# EAGLE design Hexapod_Controller_Rev1 (EAGLE 9.6.2)
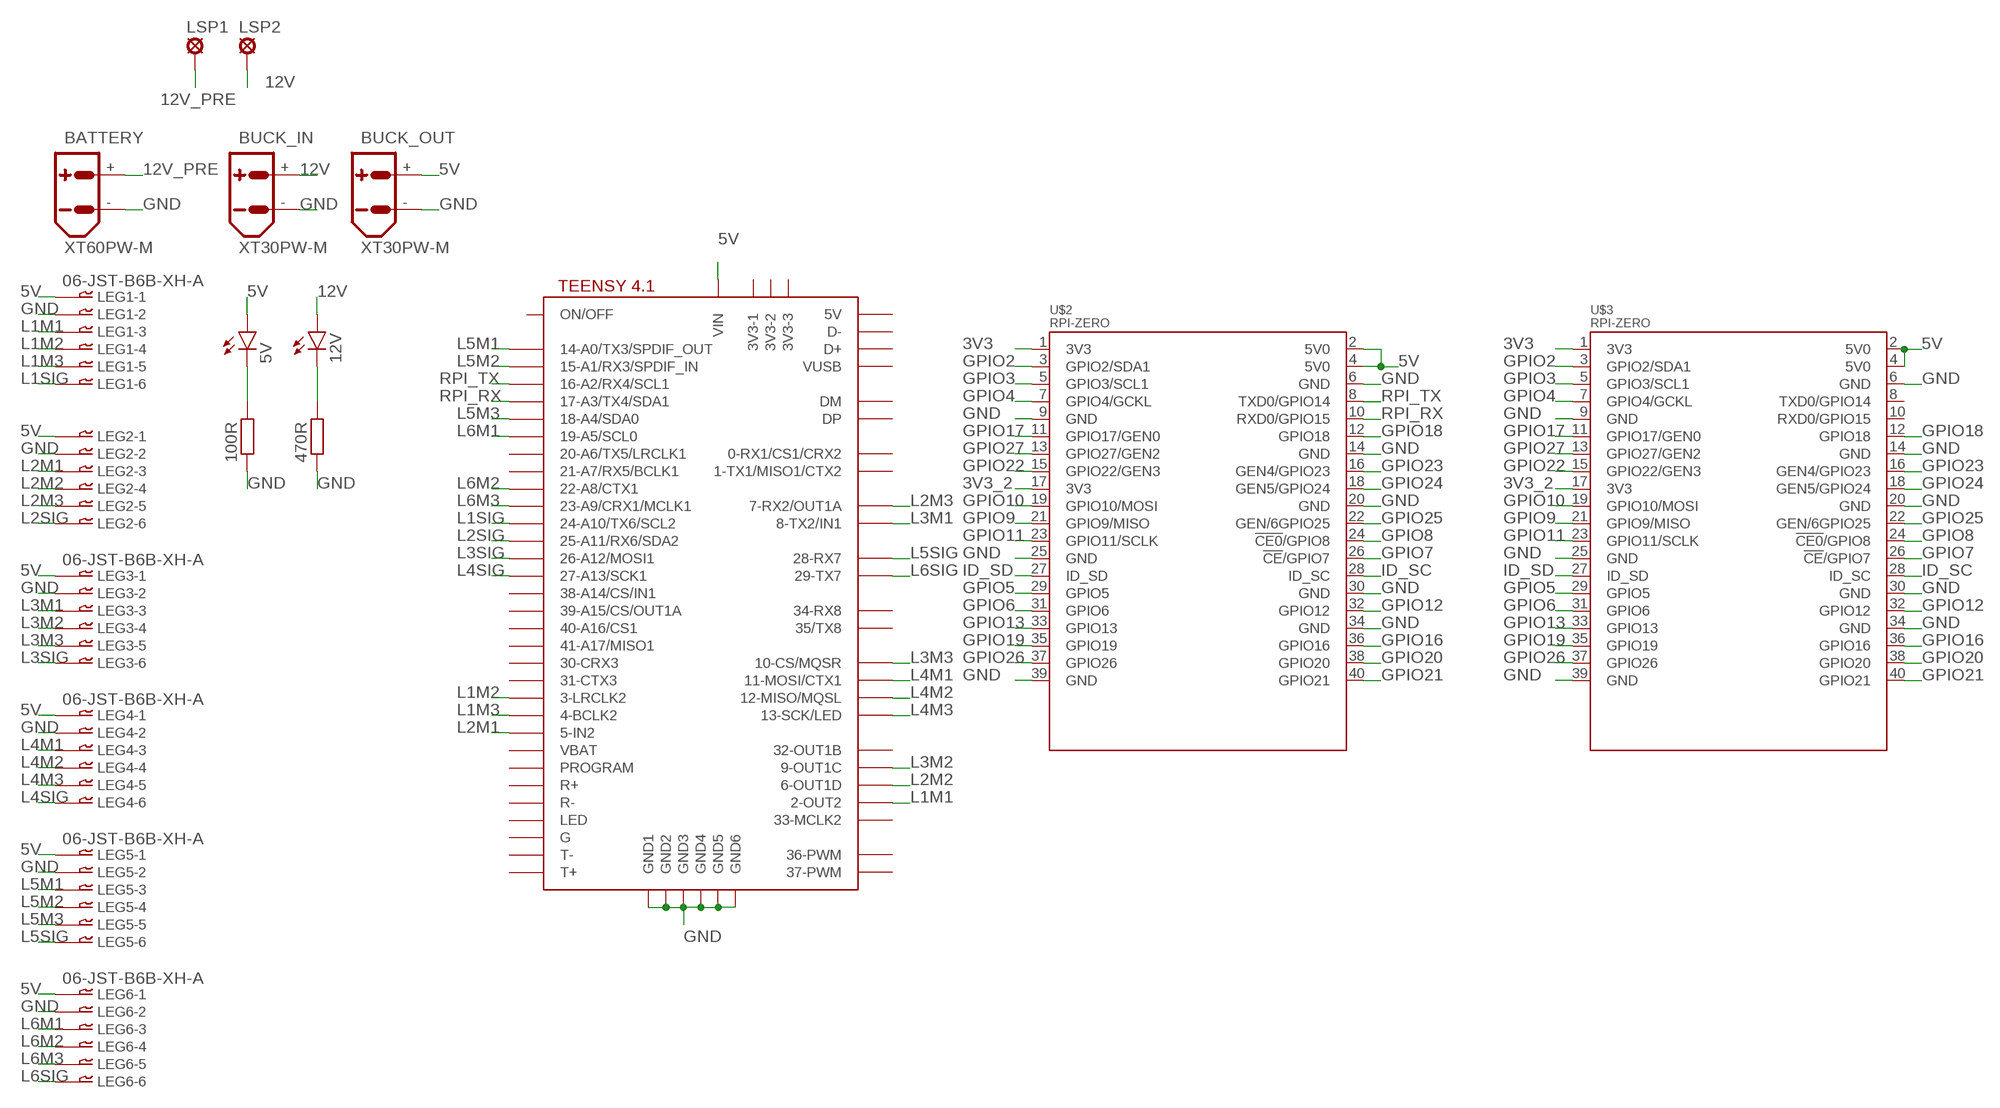
[diagram p0: schematic, sheet 1]

## Parts
5V  LEDCHIPLED_0805  [CHIPLED_0805]
12V  LEDCHIPLED_0805  [CHIPLED_0805]
100R  R-EU_R0805  [R0805]
470R  R-EU_R0805  [R0805]
BATTERY  XT60PW-M  [XT60PW-M]
BUCK_IN  XT30PW-M  [XT30PW-M]
BUCK_OUT  XT30PW-M  [XT30PW-M]
LEG1  06-JST-B6B-XH-A  [B6B-XH]
LEG2  06-JST-B6B-XH-A  [B6B-XH]
LEG3  06-JST-B6B-XH-A  [B6B-XH]
LEG4  06-JST-B6B-XH-A  [B6B-XH]
LEG5  06-JST-B6B-XH-A  [B6B-XH]
LEG6  06-JST-B6B-XH-A  [B6B-XH]
LSP1  LSP10  [LSP10]
LSP2  LSP10  [LSP10]
U$1  TEENSY41  [TEENSY41]
U$2  RPI-ZERO  [RASPBERRYPI_BASTELSTUBE_V13_RASPI_BOARD_B+_FULL]
U$3  RPI-ZERO  [RASPBERRYPI_BASTELSTUBE_V13_RASPI_BOARD_B+_FULL]

## Nets
3V3: U$2.1(3V3) U$3.1(3V3)
3V3_2: U$2.17(3V3) U$3.17(3V3)
5V: 5V.A BUCK_OUT.+ LEG1.P$1 LEG2.P$1 LEG3.P$1 LEG4.P$1 LEG5.P$1 LEG6.P$1 U$1.VIN U$2.2(5V0) U$2.4(5V0) U$3.2(5V0) U$3.4(5V0)
12V: 12V.A BUCK_IN.+ LSP2.MP
12V_PRE: BATTERY.+ LSP1.MP
GND: 100R.1 470R.1 BATTERY.- BUCK_IN.- BUCK_OUT.- LEG1.P$2 LEG2.P$2 LEG3.P$2 LEG4.P$2 LEG5.P$2 LEG6.P$2 U$1.GND1 U$1.GND2 U$1.GND3 U$1.GND4 U$1.GND5 U$1.GND6 U$2.6(GND) U$2.9(GND) U$2.14(GND) U$2.20(GND) U$2.25(GND) U$2.30(GND) U$2.34(GND) U$2.39(GND) U$3.6(GND) U$3.9(GND) U$3.14(GND) U$3.20(GND) U$3.25(GND) U$3.30(GND) U$3.34(GND) U$3.39(GND)
GPIO2: U$2.3(GPIO2/SDA1) U$3.3(GPIO2/SDA1)
GPIO3: U$2.5(GPIO3/SCL1) U$3.5(GPIO3/SCL1)
GPIO4: U$2.7(GPIO4/GCKL) U$3.7(GPIO4/GCKL)
GPIO5: U$2.29(GPIO5) U$3.29(GPIO5)
GPIO6: U$2.31(GPIO6) U$3.31(GPIO6)
GPIO7: U$2.26(!CE!/GPIO7) U$3.26(!CE!/GPIO7)
GPIO8: U$2.24(!CE0!/GPIO8) U$3.24(!CE0!/GPIO8)
GPIO9: U$2.21(GPIO9/MISO) U$3.21(GPIO9/MISO)
GPIO10: U$2.19(GPIO10/MOSI) U$3.19(GPIO10/MOSI)
GPIO11: U$2.23(GPIO11/SCLK) U$3.23(GPIO11/SCLK)
GPIO12: U$2.32(GPIO12) U$3.32(GPIO12)
GPIO13: U$2.33(GPIO13) U$3.33(GPIO13)
GPIO16: U$2.36(GPIO16) U$3.36(GPIO16)
GPIO17: U$2.11(GPIO17/GEN0) U$3.11(GPIO17/GEN0)
GPIO18: U$2.12(GPIO18) U$3.12(GPIO18)
GPIO19: U$2.35(GPIO19) U$3.35(GPIO19)
GPIO20: U$2.38(GPIO20) U$3.38(GPIO20)
GPIO21: U$2.40(GPIO21) U$3.40(GPIO21)
GPIO22: U$2.15(GPIO22/GEN3) U$3.15(GPIO22/GEN3)
GPIO23: U$2.16(GEN4/GPIO23) U$3.16(GEN4/GPIO23)
GPIO24: U$2.18(GEN5/GPIO24) U$3.18(GEN5/GPIO24)
GPIO25: U$2.22(GEN/6GPIO25) U$3.22(GEN/6GPIO25)
GPIO26: U$2.37(GPIO26) U$3.37(GPIO26)
GPIO27: U$2.13(GPIO27/GEN2) U$3.13(GPIO27/GEN2)
ID_SC: U$2.28(ID_SC) U$3.28(ID_SC)
ID_SD: U$2.27(ID_SD) U$3.27(ID_SD)
L1M1: LEG1.P$3 U$1.2-OUT2
L1M2: LEG1.P$4 U$1.3-LRCLK2
L1M3: LEG1.P$5 U$1.4-BCLK2
L1SIG: LEG1.P$6 U$1.24-A10/TX6/SCL2
L2M1: LEG2.P$3 U$1.5-IN2
L2M2: LEG2.P$4 U$1.6-OUT1D
L2M3: LEG2.P$5 U$1.7-RX2/OUT1A
L2SIG: LEG2.P$6 U$1.25-A11/RX6/SDA2
L3M1: LEG3.P$3 U$1.8-TX2/IN2(8-TX2/IN1)
L3M2: LEG3.P$4 U$1.9-OUT1C
L3M3: LEG3.P$5 U$1.10-CS\MQSR(10-CS/MQSR)
L3SIG: LEG3.P$6 U$1.26-A12/MOSI1
L4M1: LEG4.P$3 U$1.11-MOSI/CTX1
L4M2: LEG4.P$4 U$1.12-MISO/MQSL
L4M3: LEG4.P$5 U$1.13-SCK/LED
L4SIG: LEG4.P$6 U$1.27-A13/SCK1
L5M1: LEG5.P$3 U$1.14-A0/TX3/SPDIF_OUT
L5M2: LEG5.P$4 U$1.15-A1/RX3/SPDIF_IN
L5M3: LEG5.P$5 U$1.18-A4/SDA0
L5SIG: LEG5.P$6 U$1.28-RX7
L6M1: LEG6.P$3 U$1.19-A5/SCL0
L6M2: LEG6.P$4 U$1.22-A8/CTX1
L6M3: LEG6.P$5 U$1.23-A9/CRX1/MCLK1
L6SIG: LEG6.P$6 U$1.29-TX7
N$1: 5V.C 100R.2
N$2: 12V.C 470R.2
RPI_RX: U$1.17-A3/TX4/SDA1 U$2.10(RXD0/GPIO15)
RPI_TX: U$1.16-A2/RX4/SCL1 U$2.8(TXD0/GPIO14)
Unconnected: U$1.0-RX1/CS1/CRX2 U$1.1-TX1/MISO1/CTX2 U$1.3V3-1 U$1.3V3-2 U$1.3V3-3 U$1.20-A6/TX5/LRCLK1 U$1.21-A7/RX5/BCLK1 U$1.30-CRX3 U$1.31-CTX3 U$1.32-OUT1B U$1.33-MCLK2 U$1.34-RX8 U$1.35-TX8(35/TX8) U$1.36-PWM U$1.37-PWM U$1.38-A14/CS/IN1 U$1.39-A15/CS/OUT1A U$1.40-A16/CS1 U$1.41-A17/MISO1 U$1.+5V(5V) U$1.D+ U$1.D- U$1.DM U$1.DP U$1.G U$1.LED U$1.ON/OFF U$1.PROGRAM U$1.R+ U$1.R- U$1.T+ U$1.T- U$1.VBAT U$1.VUSB U$3.8(TXD0/GPIO14) U$3.10(RXD0/GPIO15)

## Library data of the parts
5V 12V = led:LED: LED OSRAM: - CHIPLED LG R971, LG N971, LY N971, LG Q971, LY Q971, LO R971, LY R971 LH N974, LH R974 LS Q976, LO Q976, LY Q976 LO Q996 - Hyper CHIPLED LW Q18S LB Q993, LB Q99A, LB R99A - SideLED LS A670, LO A670, LY A670, LG A670, LP A670 LB A673, LV A673, LT A673, LW A673 LH A674 LY A675 LS A676, LA A676, LO A676, LY A676, LW A676 LS A679, LY A679, LG A679 - Hyper Micro SIDELED® LS Y876, LA Y876, LO Y876, LY Y876 LT Y87S - SmartLED LW L88C, LW L88S LB L89C, LB L89S, LG L890 LS L89K, LO L89K, LY L89K LS L896, LA L896, LO L896, LY L896 - TOPLED LS T670, LO T670, LY T670, LG T670, LP T670 LSG T670, LSP T670, LSY T670, LOP T670, LYG T670 LG T671, LOG T671, LSG T671 LB T673, LV T673, LT T673, LW T673 LH T674 LS T676, LA T676, LO T676, LY T676, LB T676, LH T676, LSB T676, LW T676 LB T67C, LV T67C, LT T67C, LS T67K, LO T67K, LY T67K, LW E67C LS E67B, LA E67B, LO E67B, LY E67B, LB E67C, LV E67C, LT E67C LW T67C LS T679, LY T679, LG T679 LS T770, LO T770, LY T770, LG T770, LP T770 LB T773, LV T773, LT T773, LW T773 LH T774 LS E675, LA E675, LY E675, LS T675 LS T776, LA T776, LO T776, LY T776, LB T776 LHGB T686 LT T68C, LB T68C - Hyper Mini TOPLED® LB M676 - Mini TOPLED Santana® LG M470 LS M47K, LO M47K, LY M47K Source: http://www.osram.convergy.de LUXEON: - LUMILED® LXK2-PW12-R00, LXK2-PW12-S00, LXK2-PW14-U00, LXK2-PW14-V00 LXK2-PM12-R00, LXK2-PM12-S00, LXK2-PM14-U00 LXK2-PE12-Q00, LXK2-PE12-R00, LXK2-PE12-S00, LXK2-PE14-T00, LXK2-PE14-U00 LXK2-PB12-K00, LXK2-PB12-L00, LXK2-PB12-M00, LXK2-PB14-N00, LXK2-PB14-P00, LXK2-PB14-Q00 LXK2-PR12-L00, LXK2-PR12-M00, LXK2-PR14-Q00, LXK2-PR14-R00 LXK2-PD12-Q00, LXK2-PD12-R00, LXK2-PD12-S00 LXK2-PH12-R00, LXK2-PH12-S00 LXK2-PL12-P00, LXK2-PL12-Q00, LXK2-PL12-R00 Source: www.luxeon.com KINGBRIGHT: KA-3528ASYC Source: www.kingbright.com
100R 470R = rcl:R-EU_: RESISTOR, European symbol; SPICEPREFIX: R
BATTERY = amass:XT60: AMASS XT60 connector Store in Japan AMASS XT60 connector <https://szc.jp/ams-xt60>
BUCK_IN BUCK_OUT = amass:XT30: AMASS XT30 connector Store in Japan AMASS XT30 connector <https://szc.jp/ams-xt30>
LEG1-LEG6 = bt_con-jst-xh:06-JST: JST CONNECTOR
LSP1 LSP2 = solpad:LSP10: SOLDER PAD drill 1.0 mm, distributor Buerklin, 12H555
U$1 = teensy:TEENSY41
U$2 = RPI-Zero:RPI-ZERO
U$3 = RPI_outer:RPI-ZERO

## Net classes
0 default: clearance 0.205 mm

## Board
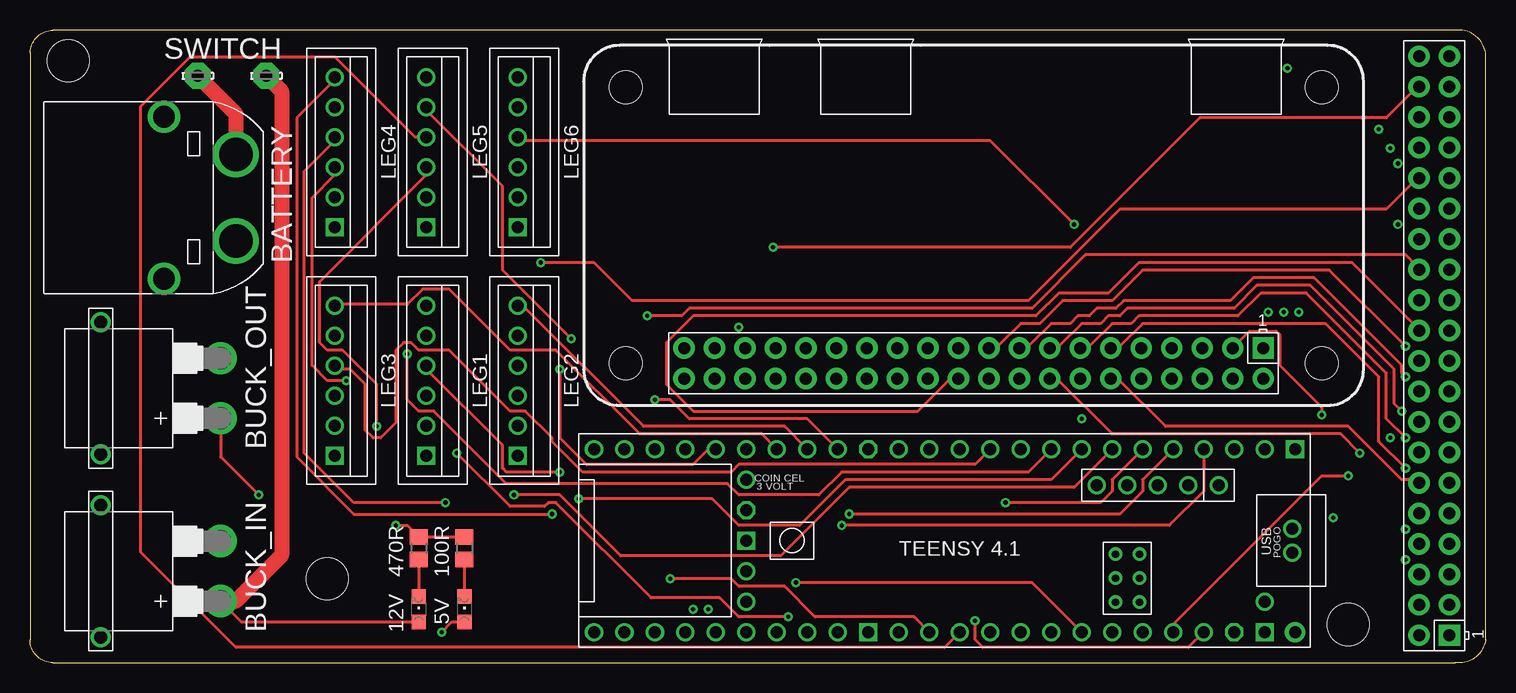
[diagram p1: board, top side]
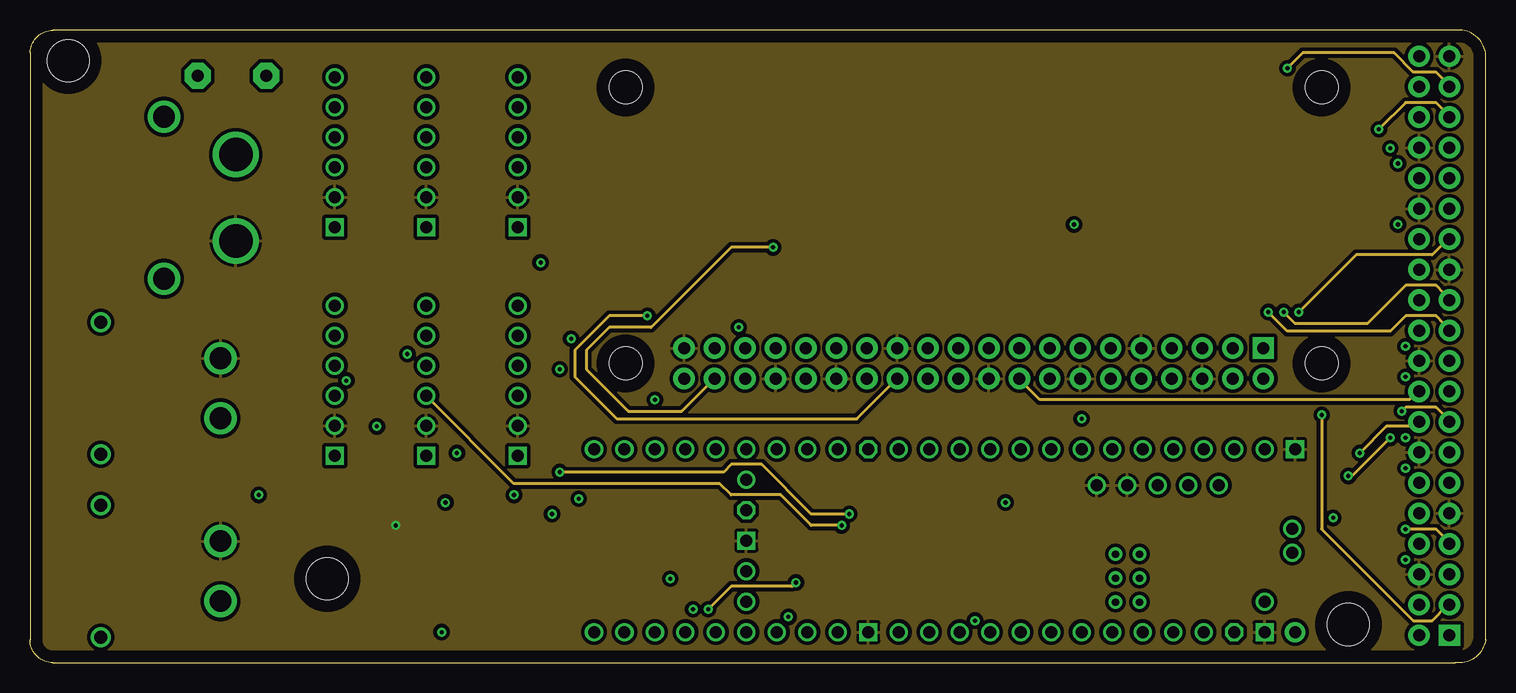
[diagram p2: board, inner layer Route2]
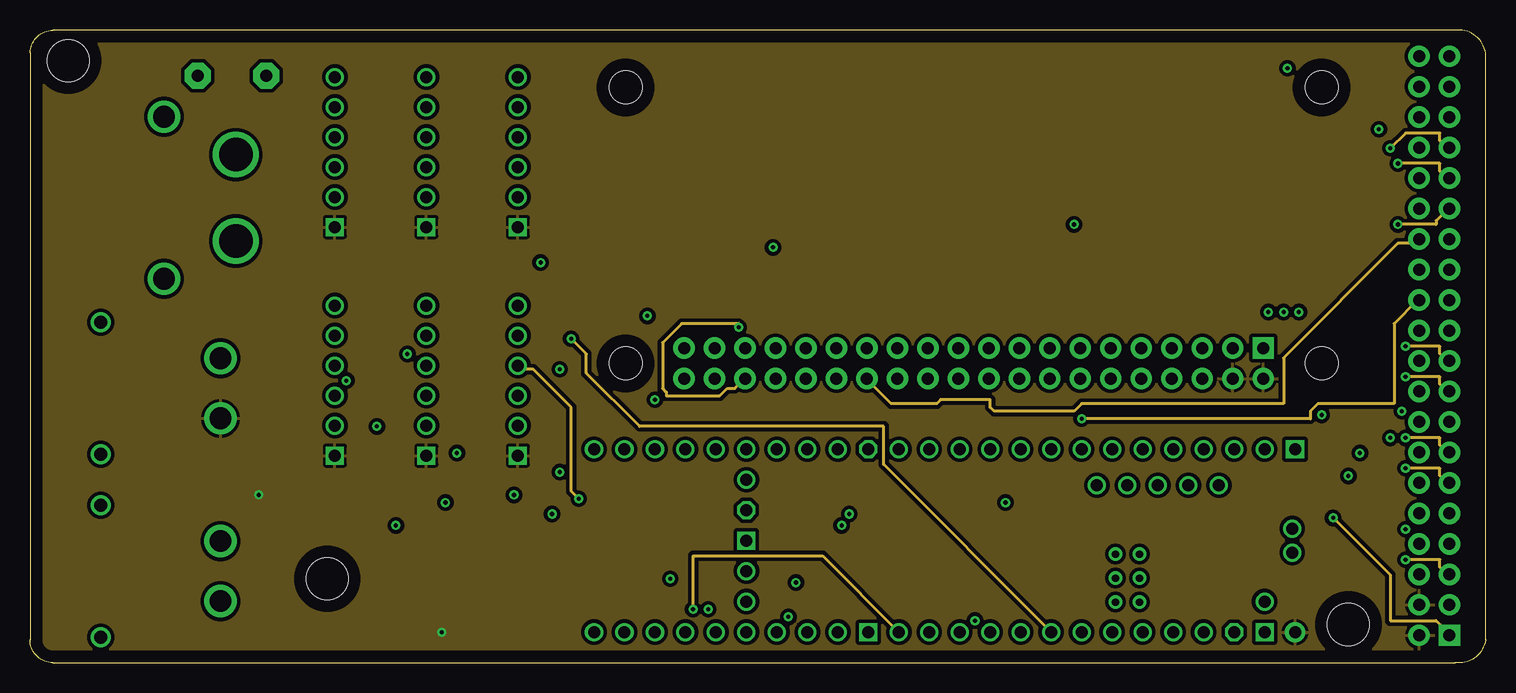
[diagram p3: board, inner layer Route15]
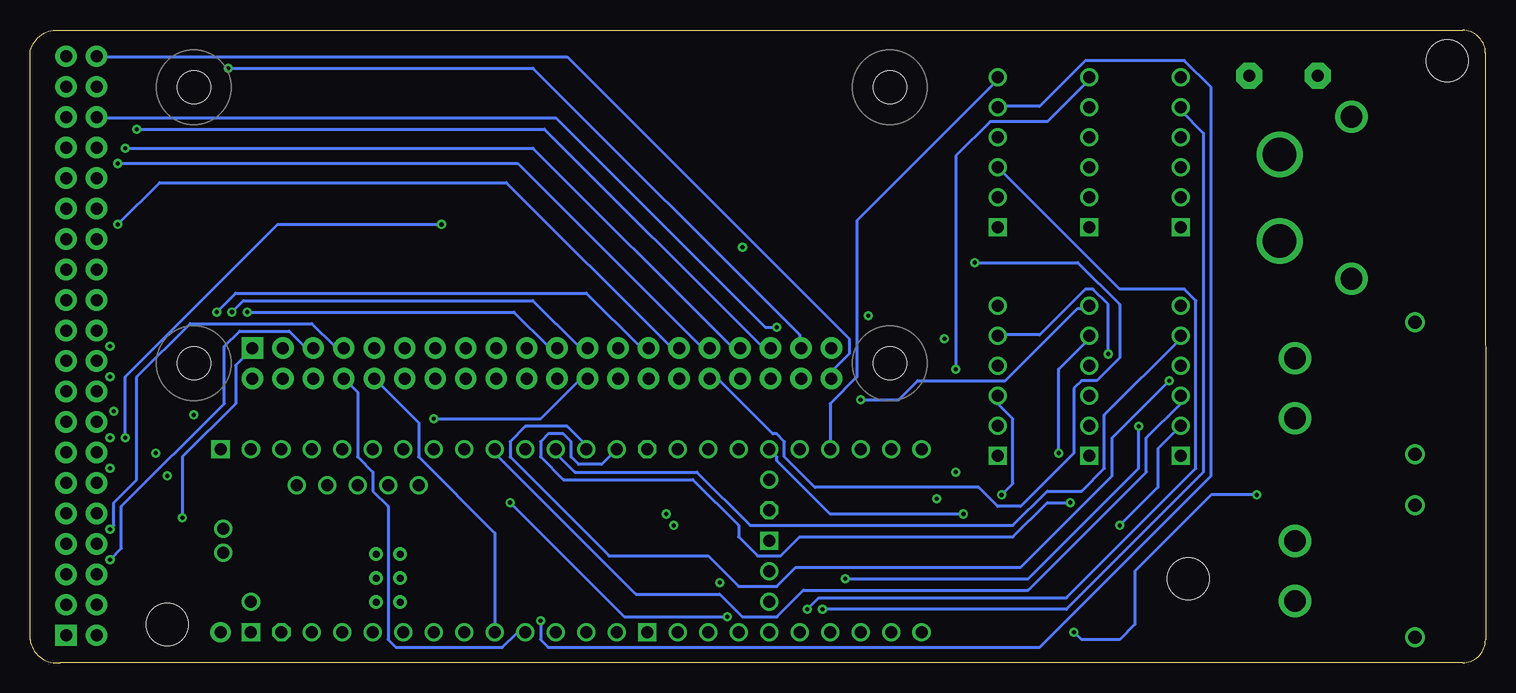
[diagram p4: board, bottom side, seen from below]

Size 121.3 x 52.74 mm. Coordinates in mm from the lower left corner, seen from the top.
Outline: 1.91,0.02 118.76,0.02 arc90 121.3,1.93 121.3,50.82 arc90 118.76,52.72 1.91,52.72 arc90 0.01,50.82 0,1.93 arc90 1.91,0.02
Copper layers (1+2*15+16): Top 0.15mm / dielectric 0.2mm / Route2 0.15mm / dielectric 0.2mm / Route15 0.15mm / dielectric 0.2mm / Bottom 0.15mm
Design rules "default *": minimum track width 10mil, minimum drill 0.35mm, track to track 12mil, track to pad 12mil, pad to pad 12mil, via to via 12mil, smd to smd 12mil, copper to edge 40mil, drill to drill 6mil, minimum pad ring 10mil, minimum via ring 8mil, stop-mask expansion 4mil, vias tented up to drill 0mil, thermal gap 10mil
Holes 3.5 mm at 3.18,50.19 24.77,7.01 109.87,3.2

### Footprints (pad centres in the part's own frame; a part is rotated, then mirrored left to right if it is on the bottom)
CHIPLED_0805 = smd 1.2 x 1.2: A 0,-1.05; C 0,1.05
R0805 = smd 1.3 x 1.5: 1 -0.95,0; 2 0.95,0
XT60PW-M = drill 2.8: + 3.6,0; - -3.6,0 | drill 1.8: P$3 -6.75,6; P$4 6.75,6
XT30PW-M = drill 1.8: + -2.5,0; - 2.5,0 | drill 1.1: P$3 -5.5,10; P$4 5.5,10
B6B-XH = drill 1 square: P$1 6.25,0 | drill 1: P$2 3.75,0; P$3 1.25,0; P$4 -1.25,0; P$5 -3.75,0; P$6 -6.25,0
LSP10 = drill 1.016 pad 2.159 octagon: MP 0,0
TEENSY41 = drill 1: 0-RX1/CS1/CRX2 -27.94,-7.62; 1-TX1/MISO1/CTX2 -25.4,-7.62; 2-OUT2 -22.86,-7.62; 3-LRCLK2 -20.32,-7.62; 4-BCLK2 -17.78,-7.62; 5-IN2 -15.24,-7.62; 6-OUT1D -12.7,-7.62; 7-RX2/OUT1A -10.16,-7.62; 8-TX2/IN2 -7.62,-7.62; 9-OUT1C -5.08,-7.62; 10-CS\MQSR -2.54,-7.62; 11-MOSI/CTX1 0,-7.62; 12-MISO/MQSL 2.54,-7.62; 13-SCK/LED 2.54,7.62; 14-A0/TX3/SPDIF_OUT 0,7.62; 15-A1/RX3/SPDIF_IN -2.54,7.62; 16-A2/RX4/SCL1 -5.08,7.62; 17-A3/TX4/SDA1 -7.62,7.62; 18-A4/SDA0 -10.16,7.62; 19-A5/SCL0 -12.7,7.62; 20-A6/TX5/LRCLK1 -15.24,7.62; 21-A7/RX5/BCLK1 -17.78,7.62; 22-A8/CTX1 -20.32,7.62; 23-A9/CRX1/MCLK1 -22.86,7.62; 24-A10/TX6/SCL2 7.62,-7.62; 25-A11/RX6/SDA2 10.16,-7.62; 26-A12/MOSI1 12.7,-7.62; 27-A13/SCK1 15.24,-7.62; 28-RX7 17.78,-7.62; 29-TX7 20.32,-7.62; 30-CRX3 22.86,-7.62; 31-CTX3 25.4,-7.62; 32-OUT1B 27.94,-7.62; 33-MCLK2 27.94,7.62; 34-RX8 25.4,7.62; 35-TX8 22.86,7.62; 36-PWM 20.32,7.62; 37-PWM 17.78,7.62; 38-A14/CS/IN1 15.24,7.62; 39-A15/CS/OUT1A 12.7,7.62; 40-A16/CS1 10.16,7.62; 41-A17/MISO1 7.62,7.62; +5V -24.13,-4.62; D+ -30.25,-1; D- -30.25,1; DM -21.59,-4.62; DP -19.05,-4.62; GND4 -16.51,-4.62; GND5 -13.97,-4.62; ON/OFF 15.24,5.08; PROGRAM 15.24,2.54; VBAT 15.24,-5.08; VUSB -27.94,5.08 | drill 1 octagon: 3V3-1 5.08,-7.62; 3V3-2 15.24,-2.54; 3V3-3 -25.4,7.62 | drill 0.6: G -15.51,3.12; LED -17.51,3.12; R+ -17.51,5.12; R- -15.51,5.12; T+ -15.51,1.12; T- -17.51,1.12 | drill 1 square: GND1 -30.48,-7.62; GND2 15.24,0; GND3 5.08,7.62; GND6 -27.94,7.62 | drill 1 pad 1.676: VIN -30.48,7.62
RASPBERRYPI_BASTELSTUBE_V13_RASPI_BOARD_B+_FULL = drill 1 pad 1.778 square: 1 8.37,25.23 | drill 1 pad 1.778: 2 8.37,27.77; 3 10.91,25.23; 4 10.91,27.77; 5 13.45,25.23; 6 13.45,27.77; 7 15.99,25.23; 8 15.99,27.77; 9 18.53,25.23; 10 18.53,27.77; 11 21.07,25.23; 12 21.07,27.77; 13 23.61,25.23; 14 23.61,27.77; 15 26.15,25.23; 16 26.15,27.77; 17 28.69,25.23; 18 28.69,27.77; 19 31.23,25.23; 20 31.23,27.77; 21 33.77,25.23; 22 33.77,27.77; 23 36.31,25.23; 24 36.31,27.77; 25 38.85,25.23; 26 38.85,27.77; 27 41.39,25.23; 28 41.39,27.77; 29 43.93,25.23; 30 43.93,27.77; 31 46.47,25.23; 32 46.47,27.77; 33 49.01,25.23; 34 49.01,27.77; 35 51.55,25.23; 36 51.55,27.77; 37 54.09,25.23; 38 54.09,27.77; 39 56.63,25.23; 40 56.63,27.77 | hole 2.75: 3.5,3.5; 3.5,26.5; 61.5,3.5; 61.5,26.5
RASPBERRYPI_BASTELSTUBE_V13_RASPI_BOARD_B+_FULL' = drill 1 pad 1.778 square: 1 8.37,25.23 | drill 1 pad 1.778: 2 8.37,27.77; 3 10.91,25.23; 4 10.91,27.77; 5 13.45,25.23; 6 13.45,27.77; 7 15.99,25.23; 8 15.99,27.77; 9 18.53,25.23; 10 18.53,27.77; 11 21.07,25.23; 12 21.07,27.77; 13 23.61,25.23; 14 23.61,27.77; 15 26.15,25.23; 16 26.15,27.77; 17 28.69,25.23; 18 28.69,27.77; 19 31.23,25.23; 20 31.23,27.77; 21 33.77,25.23; 22 33.77,27.77; 23 36.31,25.23; 24 36.31,27.77; 25 38.85,25.23; 26 38.85,27.77; 27 41.39,25.23; 28 41.39,27.77; 29 43.93,25.23; 30 43.93,27.77; 31 46.47,25.23; 32 46.47,27.77; 33 49.01,25.23; 34 49.01,27.77; 35 51.55,25.23; 36 51.55,27.77; 37 54.09,25.23; 38 54.09,27.77; 39 56.63,25.23; 40 56.63,27.77

### Placement (x,y rotation side)
5V  36.2,4.47 0 top
12V  32.4,4.47 0 top
100R  36.2,9.55 270 top
470R  32.4,9.55 270 top
BATTERY  17.16,38.76 90 top
BUCK_IN  15.88,7.64 90 top
BUCK_OUT  15.88,22.88 90 top
LEG1  33.03,23.52 270 top
LEG2  40.65,23.52 270 top
LEG3  25.41,23.52 270 top
LEG4  25.41,42.57 270 top
LEG5  33.03,42.57 270 top
LEG6  40.65,42.57 270 top
LSP1  13.98,48.92 0 top
LSP2  19.7,48.92 0 top
U$1  74.94,10.18 180 top
U$2  111.14,51.46 180 top
U$3  RPI-ZERO  [RASPBERRYPI_BASTELSTUBE_V13_RASPI_BOARD_B+_FULL']  143.52,-6.08 90 top

### Tracks (layer width: path | path; a pad name or v marks a point on that pad's centre or on a via)
3V3  (via drill 0.35)
  Route15 0.254: v108.59,12.09 113.36,7.32 113.36,3.51 117.17,3.51 118.12,2.56 U$3.1
  Bottom 0.254: v108.59,12.09 108.59,17.17 104.15,21.61 104.15,24.79 102.88,26.06 U$2.1
3V3_2  (via drill 0.35)
  Top 0.254: v114.63,23.83 114.31,24.15 114.31,24.79 107.01,32.09 101.93,32.09 100.02,30.18 91.13,30.18 90.5,29.55 88.91,29.55 88.28,28.91 87.32,28.91 86.69,28.28 85.1,28.28 83.2,26.37 82.56,26.37 U$2.17
  Route15 0.254: v114.63,23.83 117.48,23.83 117.48,23.2 118.12,22.56 118.24,22.56 U$3.17
5V  (via drill 0.35)
  Top 0.254: BUCK_OUT.+ 15.88,17.17 v19.06,13.99 | v34.3,2.56 35.16,3.42 5V.A
  Bottom 0.254: v19.06,13.99 22.87,13.99 29.22,7.64 29.22,3.2 30.49,1.93 33.66,1.93 v34.3,2.56
  pour Route15: 0.01,52.73 121.3,52.73 121.3,0.02 0.01,0.02
12V
  Top 0.254: BUCK_IN.+ 17.61,3.42 12V.A
  Top 1.27: LSP2.MP 20.96,47.65 20.96,8.95 17.16,5.14 BUCK_IN.+
12V_PRE
  Top 1.27: LSP1.MP 17.16,45.74 BATTERY.+
GND  (via drill 0.35)
  Top 0.254: 100R.1 470R.1 31.44,11.45 v30.49,11.45
  Bottom 0.254: LEG3.P$2 27.32,17.86 27.32,14.63 v30.49,11.45
  pour Route2: 0.01,52.73 121.3,52.73 121.3,0.02 0.01,0.02
GPIO2  (via drill 0.35)
  Top 0.254: v107.64,20.66 107.64,21.29 104.15,24.79 104.15,27.33 103.83,27.64 101.61,27.64 100.34,26.37 U$2.3
  Route2 0.254: v107.64,20.66 107.64,11.13 115.26,3.51 116.85,3.51 118.12,4.78 U$3.3
GPIO3  (via drill 0.35)
  Route15 0.254: v114.63,8.59 117.48,8.59 117.48,7.96 118.12,7.32 U$3.5
  Bottom 0.254: v114.63,8.59 113.67,9.55 113.67,13.04 105.1,21.61 105.1,26.37 103.83,27.64 99.7,27.64 98.44,26.37 97.8,26.37 U$2.5
GPIO4  (via drill 0.35)
  Route2 0.254: v114.63,11.13 117.17,11.13 117.8,10.5 117.8,10.18 118.12,10.18 U$3.7
  Bottom 0.254: v114.63,11.13 114.31,11.45 114.31,13.36 112.41,15.26 112.41,23.83 107.96,28.28 97.8,28.28 95.9,26.37 95.26,26.37 U$2.7
GPIO5  (via drill 0.35)
  Route15 0.254: v113.99,36.53 117.17,36.53 117.17,36.85 118.12,37.8 U$3.29
  Bottom 0.254: v113.99,36.53 110.5,40.03 81.61,40.03 67.95,26.37 67.32,26.37 U$2.29
GPIO6  (via drill 0.35)
  Route15 0.254: v113.99,41.61 117.48,41.61 117.48,40.98 118.12,40.34 U$3.31
  Bottom 0.254: v113.99,41.61 80.66,41.61 65.42,26.37 64.78,26.37 U$2.31
GPIO7  (via drill 0.35)
  Top 0.254: v51.45,28.91 54.3,28.91 54.94,29.55 83.51,29.55 87.96,33.99 114.63,33.99 115.58,33.04 U$3.26
  Route2 0.254: v51.45,28.91 48.27,28.91 45.41,26.06 45.41,23.83 48.91,20.34 68.91,20.34 72.08,23.52 U$2.26
GPIO8  (via drill 0.35)
  Route15 0.254: v87.64,20.34 106.69,20.34 106.69,20.98 107.33,21.61 113.67,21.61 113.67,28.28 115.58,30.18 U$3.24
  Bottom 0.254: v87.64,20.34 78.75,20.34 75.58,23.52 74.94,23.52 U$2.24
GPIO9  (via drill 0.35)
  Route2 0.254: v103.2,29.23 104.79,27.64 113.36,27.64 114.63,28.91 117.17,28.91 117.8,28.28 117.8,27.96 118.12,27.96 U$3.21
  Bottom 0.254: v103.2,29.23 80.97,29.23 78.11,26.37 77.48,26.37 U$2.21
GPIO10  (via drill 0.35)
  Top 0.254: v114.63,26.37 108.28,32.72 92.72,32.72 90.18,30.18 86.05,30.18 84.15,28.28 82.56,28.28 80.66,26.37 80.02,26.37 U$2.19
  Route15 0.254: v114.63,26.37 117.48,26.37 117.48,25.74 118.12,25.1 U$3.19
GPIO11  (via drill 0.35)
  Route2 0.254: v104.47,29.23 105.42,28.28 111.45,28.28 114.63,31.45 117.17,31.45 117.8,30.82 117.8,30.5 118.12,30.5 U$3.23
  Bottom 0.254: v104.47,29.23 103.52,30.18 79.39,30.18 75.58,26.37 74.94,26.37 U$2.23
GPIO12  (via drill 0.35)
  Top 0.254: v42.55,33.36 47,33.36 50.17,30.18 83.2,30.18 90.81,37.8 113.04,37.8 115.58,40.34 U$3.32
  Bottom 0.254: v42.55,33.36 33.98,33.36 30.49,29.87 30.49,25.42 32.4,23.52 33.66,23.52 34.3,22.88 34.3,17.48 38.75,13.04 40.65,13.04 42.24,14.63 55.89,14.63 58.43,17.17 58.43,18.44 59.06,19.07 59.38,19.07 63.83,23.52 64.46,23.52 U$2.32
GPIO13  (via drill 0.35)
  Route15 0.254: v113.36,42.88 114.63,44.15 117.48,44.15 117.48,43.52 118.12,42.88 U$3.33
  Bottom 0.254: v113.36,42.88 79.39,42.88 62.88,26.37 62.24,26.37 U$2.33
GPIO16  (via drill 0.35)
  Route15 0.254: v59.06,27.96 59.06,28.28 54.3,28.28 52.72,26.69 52.72,22.88 53.03,22.56 53.03,22.25 57.48,22.25 58.11,22.88 58.75,22.88 59.38,23.52 U$2.36
  Bottom 0.254: v59.06,27.96 60.02,27.96 77.48,45.42 115.58,45.42 U$3.36
GPIO17  (via drill 0.35)
  Top 0.254: v114.63,16.21 112.41,18.44 112.41,23.83 107.96,28.28 92.72,28.28 90.81,26.37 90.18,26.37 U$2.11
  Route15 0.254: v114.63,16.21 117.48,16.21 117.48,15.58 118.12,14.94 U$3.11
GPIO18
  Top 0.254: U$2.12 90.18,23.52 90.81,23.52 94.62,19.71 109.87,19.71 114.31,15.26 115.58,15.26 U$3.12
GPIO19  (via drill 0.35)
  Route2 0.254: v112.41,44.47 114.63,46.69 117.17,46.69 117.8,46.06 117.8,45.74 118.12,45.74 U$3.35
  Bottom 0.254: v112.41,44.47 78.43,44.47 60.34,26.37 59.7,26.37 U$2.35
GPIO20  (via drill 0.35)
  Top 0.254: v61.92,34.63 86.69,34.63 97.48,45.42 113.04,45.42 115.58,47.96 U$3.38
  Route2 0.254: v61.92,34.63 58.43,34.63 51.76,27.96 48.27,27.96 46.37,26.06 46.37,24.47 49.86,20.98 54.3,20.98 56.84,23.52 U$2.38
GPIO21
  Bottom 0.254: U$2.40 54.3,23.83 54.3,24.47 53.03,25.74 53.03,27.01 76.53,50.5 115.58,50.5 U$3.40
GPIO22  (via drill 0.35)
  Top 0.254: v114.31,20.98 113.67,21.61 113.67,24.47 106.69,31.45 102.25,31.45 100.34,29.55 91.45,29.55 90.81,28.91 89.86,28.91 89.23,28.28 87.64,28.28 85.73,26.37 85.1,26.37 U$2.15
  Route2 0.254: v114.31,20.98 114.63,21.29 117.17,21.29 117.8,20.66 117.8,20.34 118.12,20.34 U$3.15
GPIO23  (via drill 0.35)
  Top 0.254: v110.82,17.48 109.23,19.07 90.18,19.07 85.73,23.52 85.1,23.52 U$2.16
  Route2 0.254: v110.82,17.48 113.04,19.71 115.26,19.71 115.58,20.02 U$3.16
GPIO24
  Route2 0.254: U$2.18 82.56,23.52 84.15,21.93 114.95,21.93 115.58,22.56 U$3.18
GPIO25
  Top 0.254: U$2.22 77.16,23.52 76.53,23.52 73.99,20.98 55.25,20.98 53.03,23.2 53.03,26.69 55.25,28.91 83.83,28.91 85.73,30.82 89.86,30.82 92.4,33.36 110.18,33.36 115.58,27.96 U$3.22
GPIO26  (via drill 0.35)
  Route2 0.254: v104.79,49.55 106.06,50.82 113.67,50.82 115.26,49.23 117.17,49.23 117.8,48.6 117.8,48.28 118.12,48.28 U$3.37
  Bottom 0.254: v104.79,49.55 79.39,49.55 57.16,27.33 57.16,26.37 U$2.37
GPIO27  (via drill 0.35)
  Top 0.254: v114.63,18.75 113.04,20.34 113.04,24.15 106.37,30.82 102.56,30.82 100.66,28.91 92.4,28.91 91.77,28.28 90.18,28.28 88.28,26.37 87.64,26.37 U$2.13
  Route15 0.254: v114.63,18.75 117.48,18.75 117.48,18.12 118.12,17.48 U$3.13
ID_SC
  Route15 0.254: U$2.28 69.86,23.52 71.77,21.61 75.58,21.61 75.89,21.93 80.02,21.93 80.02,21.29 80.34,20.98 87,20.98 87.64,21.61 104.47,21.61 104.47,25.42 113.99,34.95 115.58,34.95 115.58,35.26 U$3.28
ID_SD  (via drill 0.35)
  Route2 0.254: v105.74,29.23 110.5,33.99 116.85,33.99 118.12,35.26 U$3.27
  Bottom 0.254: v105.74,29.23 104.15,30.82 74.94,30.82 70.5,26.37 69.86,26.37 U$2.27
L1M1  (via drill 0.35)
  Top 0.254: v67.64,11.45 94.94,11.45 97.8,14.31 U$1.2-OUT2
  Route2 0.254: v67.64,11.45 65.1,11.45 62.56,13.99 58.43,13.99 57.48,14.94 40.33,14.94 33.03,22.25 LEG1.P$3
L1M2  (via drill 0.35)
  Top 0.254: v44.14,15.9 39.7,15.9 39.38,16.21 39.38,18.12 33.03,24.47 LEG1.P$4 | v68.27,12.4 90.81,12.4 92.72,14.31 92.72,15.26 U$1.3-LRCLK2
  Route2 0.254: v44.14,15.9 57.8,15.9 58.43,16.53 60.97,16.53 65.1,12.4 v68.27,12.4
L1M3  (via drill 0.35)
  Top 0.254: v35.57,17.48 40.02,13.04 42.87,13.04 43.19,13.36 43.83,13.36 51.76,5.42 57.48,5.42 59.06,3.83 v63.19,3.83 | v81.29,13.36 89.23,13.36 90.18,14.31 90.18,15.26 U$1.4-BCLK2
  Bottom 0.254: v35.57,17.48 35.57,24.47 33.03,27.01 LEG1.P$5 | v63.19,3.83 71.77,3.83 v81.29,13.36
L1SIG  (via drill 0.35)
  Top 0.254: v52.08,21.93 53.35,21.93 54.94,20.34 64.78,20.34 U$1.24-A10/TX6/SCL2
  Bottom 0.254: v52.08,21.93 48.91,21.93 47.32,23.52 40.02,23.52 33.98,29.55 33.03,29.55 LEG1.P$6
L2M1  (via drill 0.35)
  Top 0.254: v40.33,13.99 44.14,13.99 49.22,8.91 62.56,8.91 68.27,14.63 87,14.63 U$1.5-IN2
  Bottom 0.254: LEG2.P$3 40.65,21.61 39.38,20.34 39.38,14.94 v40.33,13.99
L2M2  (via drill 0.35)
  Top 0.254: v45.73,13.67 56.84,13.67 59.06,11.45 64.14,11.45 67.95,15.26 85.1,15.26 U$1.6-OUT1D
  Route15 0.254: v45.73,13.67 45.09,14.31 45.09,21.29 41.92,24.47 40.65,24.47 LEG2.P$4
L2M3  (via drill 0.35)
  Top 0.254: v31.44,25.74 31.44,21.93 32.4,20.98 33.66,20.98 39.7,14.94 58.11,14.94 59.06,13.99 65.73,13.99 67.64,15.9 83.2,15.9 U$1.7-RX2/OUT1A
  Bottom 0.254: v31.44,25.74 31.44,29.87 32.71,31.14 33.35,31.14 37.16,27.33 40.65,27.33 LEG2.P$5
L2SIG
  Top 0.254: U$1.25-A11/RX6/SDA2 62.88,19.71 51.13,19.71 41.28,29.55 40.65,29.55 LEG2.P$6
L3M1
  Bottom 0.254: LEG3.P$3 25.41,21.61 28.27,18.75 28.27,15.9 38.11,6.05 56.84,6.05 59.06,3.83 61.92,3.83 63.83,5.74 70.81,5.74 82.56,17.48 U$1.8-TX2/IN2
L3M2
  Top 0.254: U$1.9-OUT1C 78.75,16.53 59.06,16.53 58.43,15.9 46.05,15.9 43.51,18.44 43.51,18.75 41.28,20.98 40.02,20.98 34.94,26.06 32.4,26.06 31.76,26.69 31.12,26.69 30.49,26.06 30.49,20.02 29.22,18.75 28.59,18.75 27.95,19.39 27.95,23.2 26.68,24.47 25.41,24.47 LEG3.P$4
L3M3
  Bottom 0.254: U$1.10-CS\MQSR 77.48,17.48 75.89,15.9 65.73,15.9 61.29,11.45 39.38,11.45 36.52,14.31 33.66,14.31 31.76,16.21 31.76,20.66 25.41,27.01 LEG3.P$5
L3SIG
  Top 0.254: U$1.26-A12/MOSI1 60.97,19.07 50.81,19.07 43.83,26.06 40.02,26.06 34.94,31.14 32.71,31.14 31.44,29.87 25.41,29.87 LEG3.P$6
L4M1  (via drill 0.35)
  Top 0.254: LEG4.P$3 25.41,40.66 23.51,38.76 23.51,24.79 24.77,23.52 v26.36,23.52
  Bottom 0.254: v26.36,23.52 31.12,18.75 31.12,15.58 38.75,7.96 57.48,7.96 59.06,6.37 62.24,6.37 64.78,8.91 73.03,8.91 81.29,17.17 81.29,18.44 80.02,19.71 76.53,19.71 74.94,18.12 U$1.11-MOSI/CTX1
L4M2  (via drill 0.35)
  Top 0.254: v34.62,13.36 27,13.36 22.87,17.48 22.87,40.98 25.41,43.52 LEG4.P$4
  Bottom 0.254: v34.62,13.36 36.52,13.36 39.38,10.5 57.16,10.5 58.75,8.91 60.65,8.91 62.24,10.5 62.24,11.45 66.05,15.26 76.84,15.26 78.75,17.17 78.75,18.44 78.11,19.07 76.84,19.07 76.21,18.44 76.21,17.17 75.58,16.53 73.67,16.53 U$1.12-MISO/MQSL
L4M3  (via drill 0.35)
  Route15 0.254: U$1.13-SCK/LED 66.05,8.91 55.25,8.91 v55.25,4.47
  Bottom 0.254: v55.25,4.47 34.94,4.47 23.51,15.9 23.51,44.15 25.41,46.06 LEG4.P$5
L4SIG  (via drill 0.35)
  Top 0.254: v43.51,12.4 27,12.4 22.23,17.17 22.23,45.42 25.41,48.6 LEG4.P$6
  Bottom 0.254: U$1.27-A13/SCK1 59.06,17.17 59.06,16.85 54.62,12.4 v43.51,12.4
L5M1  (via drill 0.35)
  Top 0.254: LEG5.P$3 33.03,40.66 24.14,31.77 24.14,26.69 24.77,26.06 26.05,26.06 28.9,23.2 v28.9,19.71 | v53.35,7.01 58.43,7.01 59.06,6.37 62.88,6.37 65.42,3.83 73.67,3.83 U$1.14-A0/TX3/SPDIF_OUT
  Bottom 0.254: v28.9,19.71 28.9,16.21 38.11,7.01 v53.35,7.01
L5M2
  Top 0.254: U$1.15-A1/RX3/SPDIF_IN 76.21,1.29 17.16,1.29 9.22,9.23 9.22,46.38 13.34,50.5 25.41,50.5 32.08,43.84 33.03,43.84 LEG5.P$4
L5M3  (via drill 0.35)
  Top 0.254: v45.09,27.01 39.38,32.72 39.38,39.71 33.03,46.06 LEG5.P$5
  Route15 0.254: v45.09,27.01 46.37,25.74 46.37,24.15 50.81,19.71 71.13,19.71 71.13,16.53 U$1.18-A4/SDA0
L5SIG  (via drill 0.35)
  Top 0.254: U$1.28-RX7 56.53,17.8 55.25,16.53 46.37,16.53 44.14,18.75 v44.14,24.47
  Bottom 0.254: v44.14,24.47 44.14,42.25 41.28,45.11 36.52,45.11 33.03,48.6 LEG5.P$6
L6M1  (via drill 0.35)
  Top 0.254: v63.83,6.69 83.51,6.69 U$1.19-A5/SCL0
  Route2 0.254: v56.53,4.47 58.43,6.37 63.51,6.37 v63.83,6.69
  Bottom 0.254: v56.53,4.47 55.57,5.42 34.94,5.42 24.14,16.21 24.14,30.18 25.09,31.14 30.49,31.14 40.65,41.3 LEG6.P$3
L6M2  (via drill 0.35)
  Top 0.254: v87,36.53 80.02,43.52 40.65,43.52 LEG6.P$4 | v109.87,15.58 107.64,15.58 95.26,3.2 U$1.22-A8/CTX1
  Route2 0.254: v113.36,18.75 110.18,15.58 v109.87,15.58
  Bottom 0.254: v87,36.53 100.66,36.53 113.36,23.83 v113.36,18.75
L6M3  (via drill 0.35)
  Top 0.254: v78.75,3.51 78.75,1.93 79.39,1.29 96.53,1.29 U$1.23-A9/CRX1/MCLK1
  Bottom 0.254: v78.75,3.51 78.75,1.93 78.11,1.29 37.16,1.29 22.87,15.58 22.87,47.96 25.09,50.19 33.35,50.19 37.16,46.38 40.65,46.38 LEG6.P$5
L6SIG
  Bottom 0.254: U$1.29-TX7 54.62,21.61 52.4,23.83 52.4,36.85 40.65,48.6 LEG6.P$6
N$1
  Top 0.254: 100R.2 5V.C
N$2
  Top 0.254: 470R.2 12V.C
RPI_RX
  Bottom 0.254: U$1.17-A3/TX4/SDA1 82.56,10.82 88.91,17.17 88.91,20.02 92.4,23.52 U$2.10
RPI_TX
  Bottom 0.254: U$1.16-A2/RX4/SCL1 80.66,2.56 81.92,1.29 90.81,1.29 91.45,1.93 91.45,13.04 92.72,14.31 92.72,15.9 93.99,17.17 93.99,22.56 94.94,23.52 U$2.8

### Text on the board
tPlace: SWITCH